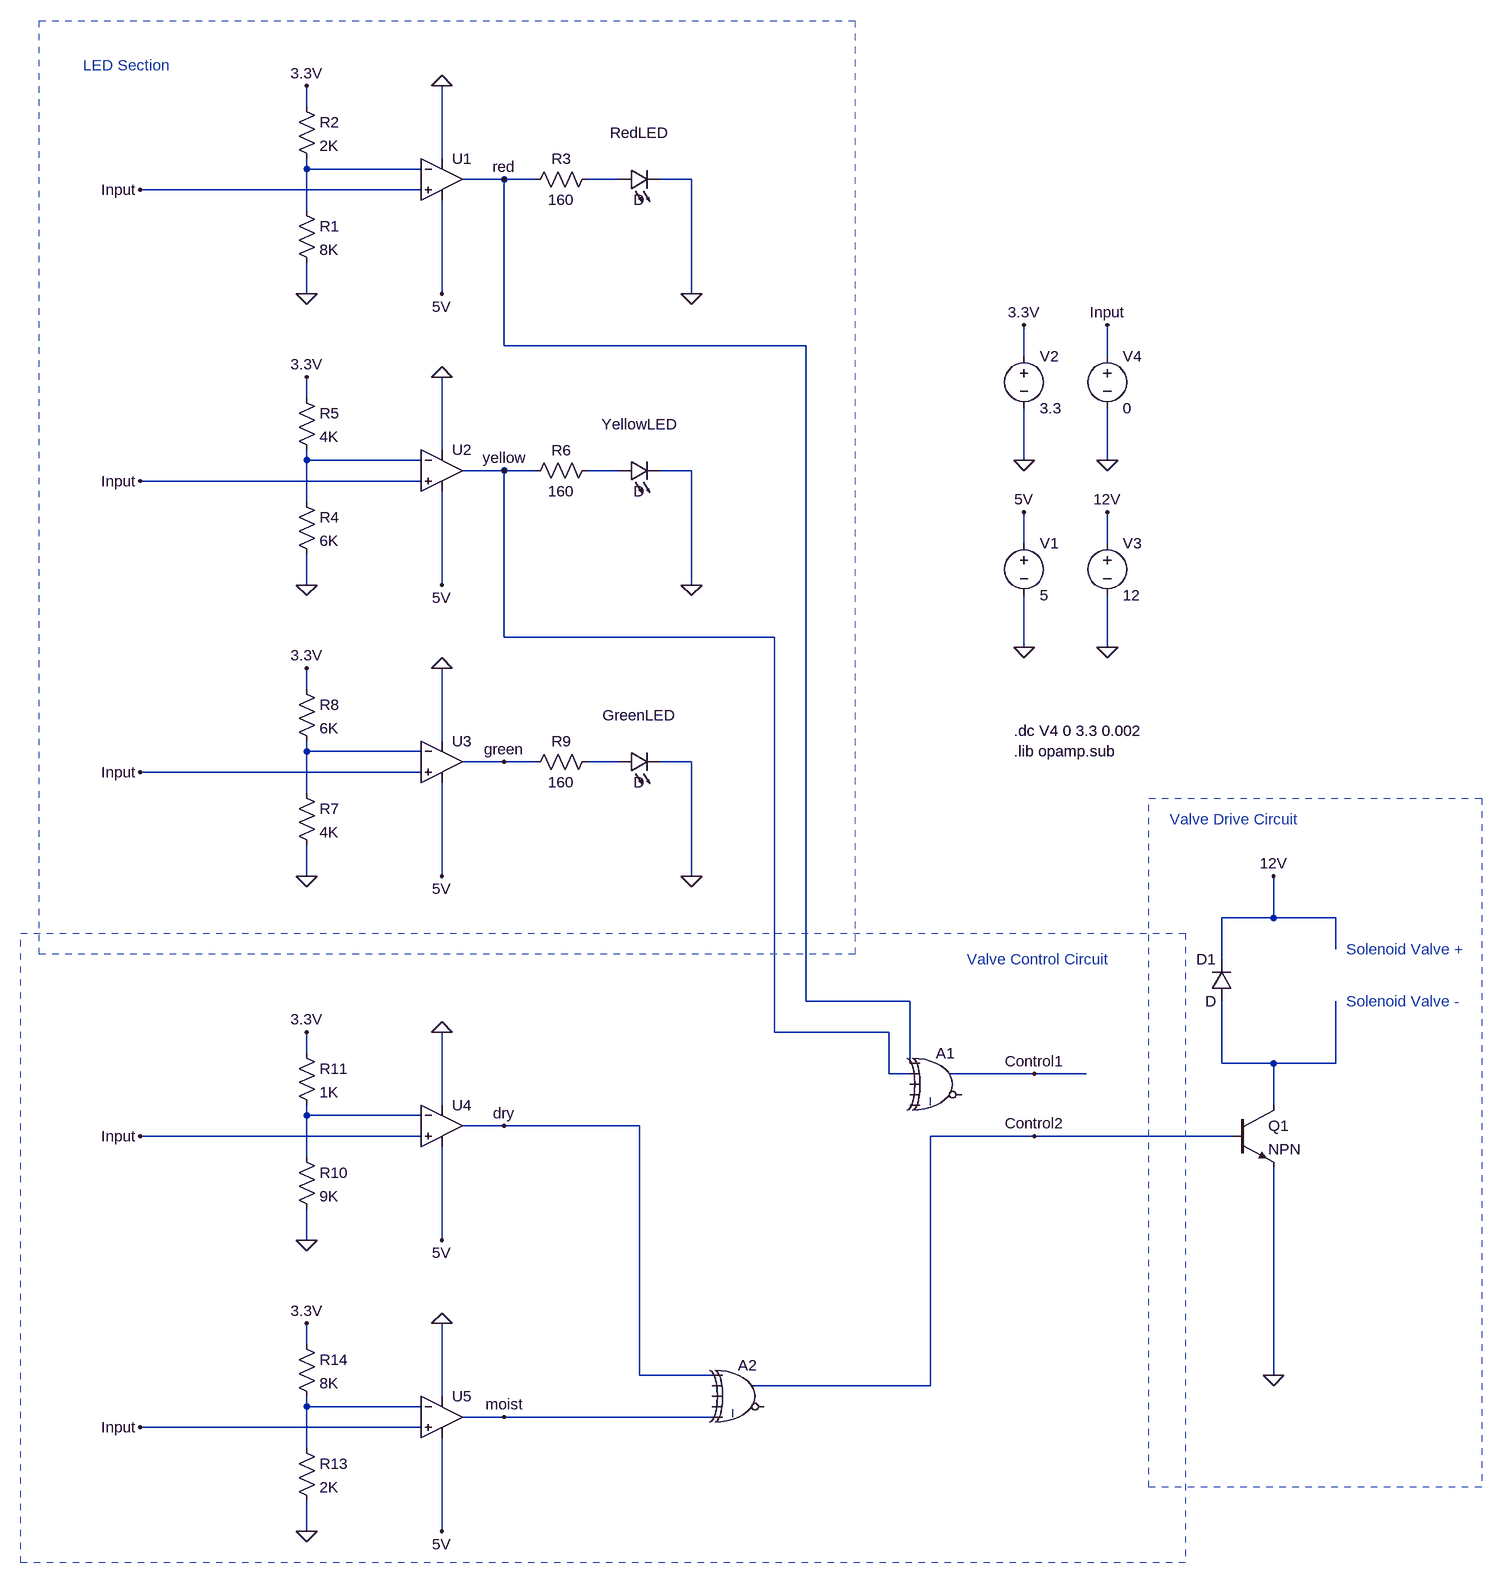
[diagram p0: schematic Led & Valve Submodule.asc]
Led & Valve Submodule.asc, the LTspice schematic file:
Version 4
SHEET 1 1892 2388
WIRE -432 128 -432 96
WIRE -224 208 -224 96
WIRE -432 224 -432 208
WIRE -256 224 -432 224
WIRE -128 240 -192 240
WIRE -80 240 -128 240
WIRE 48 240 0 240
WIRE 160 240 112 240
WIRE -256 256 -688 256
WIRE -432 288 -432 224
WIRE -432 416 -432 368
WIRE -224 416 -224 272
WIRE 160 416 160 240
WIRE -128 496 -128 240
WIRE 336 496 -128 496
WIRE 672 512 672 464
WIRE 800 512 800 464
WIRE -432 576 -432 544
WIRE -224 656 -224 544
WIRE -432 672 -432 656
WIRE -256 672 -432 672
WIRE 672 672 672 592
WIRE 800 672 800 592
WIRE -128 688 -192 688
WIRE -80 688 -128 688
WIRE 48 688 0 688
WIRE 160 688 112 688
WIRE -256 704 -688 704
WIRE -432 736 -432 672
WIRE 672 800 672 752
WIRE 800 800 800 752
WIRE -432 864 -432 816
WIRE -224 864 -224 720
WIRE 160 864 160 688
WIRE -128 944 -128 688
WIRE 288 944 -128 944
WIRE 672 960 672 880
WIRE 800 960 800 880
WIRE -432 1024 -432 992
WIRE -224 1104 -224 992
WIRE -432 1120 -432 1104
WIRE -256 1120 -432 1120
WIRE -128 1136 -192 1136
WIRE -80 1136 -128 1136
WIRE 48 1136 0 1136
WIRE 160 1136 112 1136
WIRE -256 1152 -688 1152
WIRE -432 1184 -432 1120
WIRE -432 1312 -432 1264
WIRE -224 1312 -224 1168
WIRE 160 1312 160 1136
WIRE 1056 1376 1056 1312
WIRE 1056 1376 976 1376
WIRE 1152 1376 1056 1376
WIRE 1152 1424 1152 1376
WIRE 976 1440 976 1376
WIRE 336 1504 336 496
WIRE 496 1504 336 1504
WIRE 288 1552 288 944
WIRE 464 1552 288 1552
WIRE -432 1584 -432 1552
WIRE 496 1600 496 1504
WIRE 976 1600 976 1504
WIRE 1056 1600 976 1600
WIRE 1152 1600 1152 1504
WIRE 1152 1600 1056 1600
WIRE 464 1616 464 1552
WIRE 496 1616 464 1616
WIRE 688 1616 560 1616
WIRE 768 1616 688 1616
WIRE -224 1664 -224 1552
WIRE 1056 1664 1056 1600
WIRE -432 1680 -432 1664
WIRE -256 1680 -432 1680
WIRE -128 1696 -192 1696
WIRE 80 1696 -128 1696
WIRE -256 1712 -688 1712
WIRE 688 1712 528 1712
WIRE 992 1712 688 1712
WIRE -432 1744 -432 1680
WIRE -432 1872 -432 1824
WIRE -224 1872 -224 1728
WIRE -432 2032 -432 2000
WIRE 80 2080 80 1696
WIRE 192 2080 80 2080
WIRE 1056 2080 1056 1760
WIRE 528 2096 528 1712
WIRE 528 2096 256 2096
WIRE -224 2112 -224 2000
WIRE -432 2128 -432 2112
WIRE -256 2128 -432 2128
WIRE -128 2144 -192 2144
WIRE 192 2144 -128 2144
WIRE -256 2160 -688 2160
WIRE -432 2192 -432 2128
WIRE -432 2320 -432 2272
WIRE -224 2320 -224 2176
FLAG 672 960 0
FLAG 672 752 5V
FLAG 672 672 0
FLAG -224 416 5V
FLAG 800 672 0
FLAG 800 464 Input
FLAG -224 96 0
FLAG -688 256 Input
FLAG -432 416 0
FLAG -432 96 3.3V
FLAG 160 416 0
FLAG -224 864 5V
FLAG -224 544 0
FLAG -688 704 Input
FLAG -432 864 0
FLAG -432 544 3.3V
FLAG 160 864 0
FLAG -224 1312 5V
FLAG -224 992 0
FLAG -688 1152 Input
FLAG -432 1312 0
FLAG -432 992 3.3V
FLAG 160 1312 0
FLAG -128 240 red
FLAG -128 688 yellow
FLAG -128 1136 green
FLAG -224 1872 5V
FLAG -224 1552 0
FLAG -688 1712 Input
FLAG -432 1872 0
FLAG -432 1552 3.3V
FLAG -224 2320 5V
FLAG -224 2000 0
FLAG -688 2160 Input
FLAG -432 2320 0
FLAG -432 2000 3.3V
FLAG -128 1696 dry
FLAG -128 2144 moist
FLAG 688 1616 Control1
FLAG 688 1712 Control2
FLAG 800 960 0
FLAG 800 752 12V
FLAG 1056 1312 12V
FLAG 1056 2080 0
FLAG 672 464 3.3V
SYMBOL voltage 672 784 R0
SYMATTR InstName V1
SYMATTR Value 5
SYMBOL voltage 672 496 R0
SYMATTR InstName V2
SYMATTR Value 3.3
SYMBOL Opamps/UniversalOpamp2 -224 240 R0
SYMATTR InstName U1
SYMBOL voltage 800 496 R0
SYMATTR InstName V4
SYMATTR Value 0
SYMBOL res -448 272 R0
SYMATTR InstName R1
SYMATTR Value 8K
SYMBOL res -448 112 R0
SYMATTR InstName R2
SYMATTR Value 2K
SYMBOL res 16 224 R90
WINDOW 0 0 56 VBottom 2
WINDOW 3 32 56 VTop 2
SYMATTR InstName R3
SYMATTR Value 160
SYMBOL Opamps/UniversalOpamp2 -224 688 R0
SYMATTR InstName U2
SYMBOL res -448 720 R0
SYMATTR InstName R4
SYMATTR Value 6K
SYMBOL res -448 560 R0
SYMATTR InstName R5
SYMATTR Value 4K
SYMBOL res 16 672 R90
WINDOW 0 0 56 VBottom 2
WINDOW 3 32 56 VTop 2
SYMATTR InstName R6
SYMATTR Value 160
SYMBOL Opamps/UniversalOpamp2 -224 1136 R0
SYMATTR InstName U3
SYMBOL res -448 1168 R0
SYMATTR InstName R7
SYMATTR Value 4K
SYMBOL res -448 1008 R0
SYMATTR InstName R8
SYMATTR Value 6K
SYMBOL res 16 1120 R90
WINDOW 0 0 56 VBottom 2
WINDOW 3 32 56 VTop 2
SYMATTR InstName R9
SYMATTR Value 160
SYMBOL LED 48 256 R270
WINDOW 0 72 32 VTop 2
WINDOW 3 0 32 VBottom 2
SYMATTR InstName RedLED
SYMBOL LED 48 704 R270
WINDOW 0 72 32 VTop 2
WINDOW 3 0 32 VBottom 2
SYMATTR InstName YellowLED
SYMBOL LED 48 1152 R270
WINDOW 0 72 32 VTop 2
WINDOW 3 0 32 VBottom 2
SYMATTR InstName GreenLED
SYMBOL Opamps/UniversalOpamp2 -224 1696 R0
SYMATTR InstName U4
SYMBOL res -448 1728 R0
SYMATTR InstName R10
SYMATTR Value 9K
SYMBOL res -448 1568 R0
SYMATTR InstName R11
SYMATTR Value 1K
SYMBOL res -448 2176 R0
SYMATTR InstName R13
SYMATTR Value 2K
SYMBOL res -448 2016 R0
SYMATTR InstName R14
SYMATTR Value 8K
SYMBOL npn 992 1664 R0
SYMATTR InstName Q1
SYMBOL voltage 800 784 R0
SYMATTR InstName V3
SYMATTR Value 12
SYMBOL diode 992 1504 R180
WINDOW 0 24 64 Left 2
WINDOW 3 24 0 Left 2
SYMATTR InstName D1
SYMBOL Digital/xor 544 1568 R0
SYMATTR InstName A1
SYMBOL Digital/xor 240 2048 R0
SYMATTR InstName A2
SYMBOL Opamps/UniversalOpamp2 -224 2144 R0
SYMATTR InstName U5
TEXT 656 1088 Left 2 !.dc V4 0 3.3 0.002
TEXT 656 1120 Left 2 !.lib opamp.sub
TEXT -776 64 Left 2 ;LED Section
TEXT 584 1440 Left 2 ;Valve Control Circuit
TEXT 1168 1504 Left 2 ;Solenoid Valve -
TEXT 1168 1424 Left 2 ;Solenoid Valve +
TEXT 896 1224 Left 2 ;Valve Drive Circuit
RECTANGLE Normal 412 1432 -844 -4 2
RECTANGLE Normal -872 1400 920 2368 2
RECTANGLE Normal 864 1192 1376 2252 2

The netlist it stands for:
* Led & Valve Submodule.asc
V1 5V 0 5
V2 3.3V 0 3.3
XU1 Input N001 0 5V red level.2 Avol=1Meg GBW=10Meg Slew=10Meg ilimit=25m rail=0 Vos=0 phimargin=45 en=0 enk=0 in=0 ink=0 Rin=500Meg  ; pins IN+ IN- V+ V- OUT
V4 Input 0 0
R1 N001 0 8K
R2 3.3V N001 2K
R3 N002 red 160
XU2 Input N003 0 5V yellow level.2 Avol=1Meg GBW=10Meg Slew=10Meg ilimit=25m rail=0 Vos=0 phimargin=45 en=0 enk=0 in=0 ink=0 Rin=500Meg  ; pins IN+ IN- V+ V- OUT
R4 N003 0 6K
R5 3.3V N003 4K
R6 N004 yellow 160
XU3 Input N005 0 5V green level.2 Avol=1Meg GBW=10Meg Slew=10Meg ilimit=25m rail=0 Vos=0 phimargin=45 en=0 enk=0 in=0 ink=0 Rin=500Meg  ; pins IN+ IN- V+ V- OUT
R7 N005 0 4K
R8 3.3V N005 6K
R9 N006 green 160
D§RedLED N002 0 D
D§YellowLED N004 0 D
D§GreenLED N006 0 D
XU4 Input N008 0 5V dry level.2 Avol=1Meg GBW=10Meg Slew=10Meg ilimit=25m rail=0 Vos=0 phimargin=45 en=0 enk=0 in=0 ink=0 Rin=500Meg  ; pins IN+ IN- V+ V- OUT
R10 N008 0 9K
R11 3.3V N008 1K
R13 N009 0 2K
R14 3.3V N009 8K
Q1 N007 Control2 0 0 NPN
V3 12V 0 12
D1 N007 12V D
A1 red yellow 0 0 0 0 Control1 0 XOR
A2 dry 0 0 0 moist 0 Control2 0 XOR
XU5 Input N009 0 5V moist level.2 Avol=1Meg GBW=10Meg Slew=10Meg ilimit=25m rail=0 Vos=0 phimargin=45 en=0 enk=0 in=0 ink=0 Rin=500Meg  ; pins IN+ IN- V+ V- OUT
.model D D
.lib standard.dio
.model NPN NPN
.model PNP PNP
.lib standard.bjt
.dc V4 0 3.3 0.002
.lib opamp.sub
* LED Section
* Valve Control Circuit
* Solenoid Valve -
* Solenoid Valve +
* Valve Drive Circuit
.lib UniversalOpamps2.sub
.backanno
.end